# EAGLE design me433-hw4 (EAGLE 9.6.2)
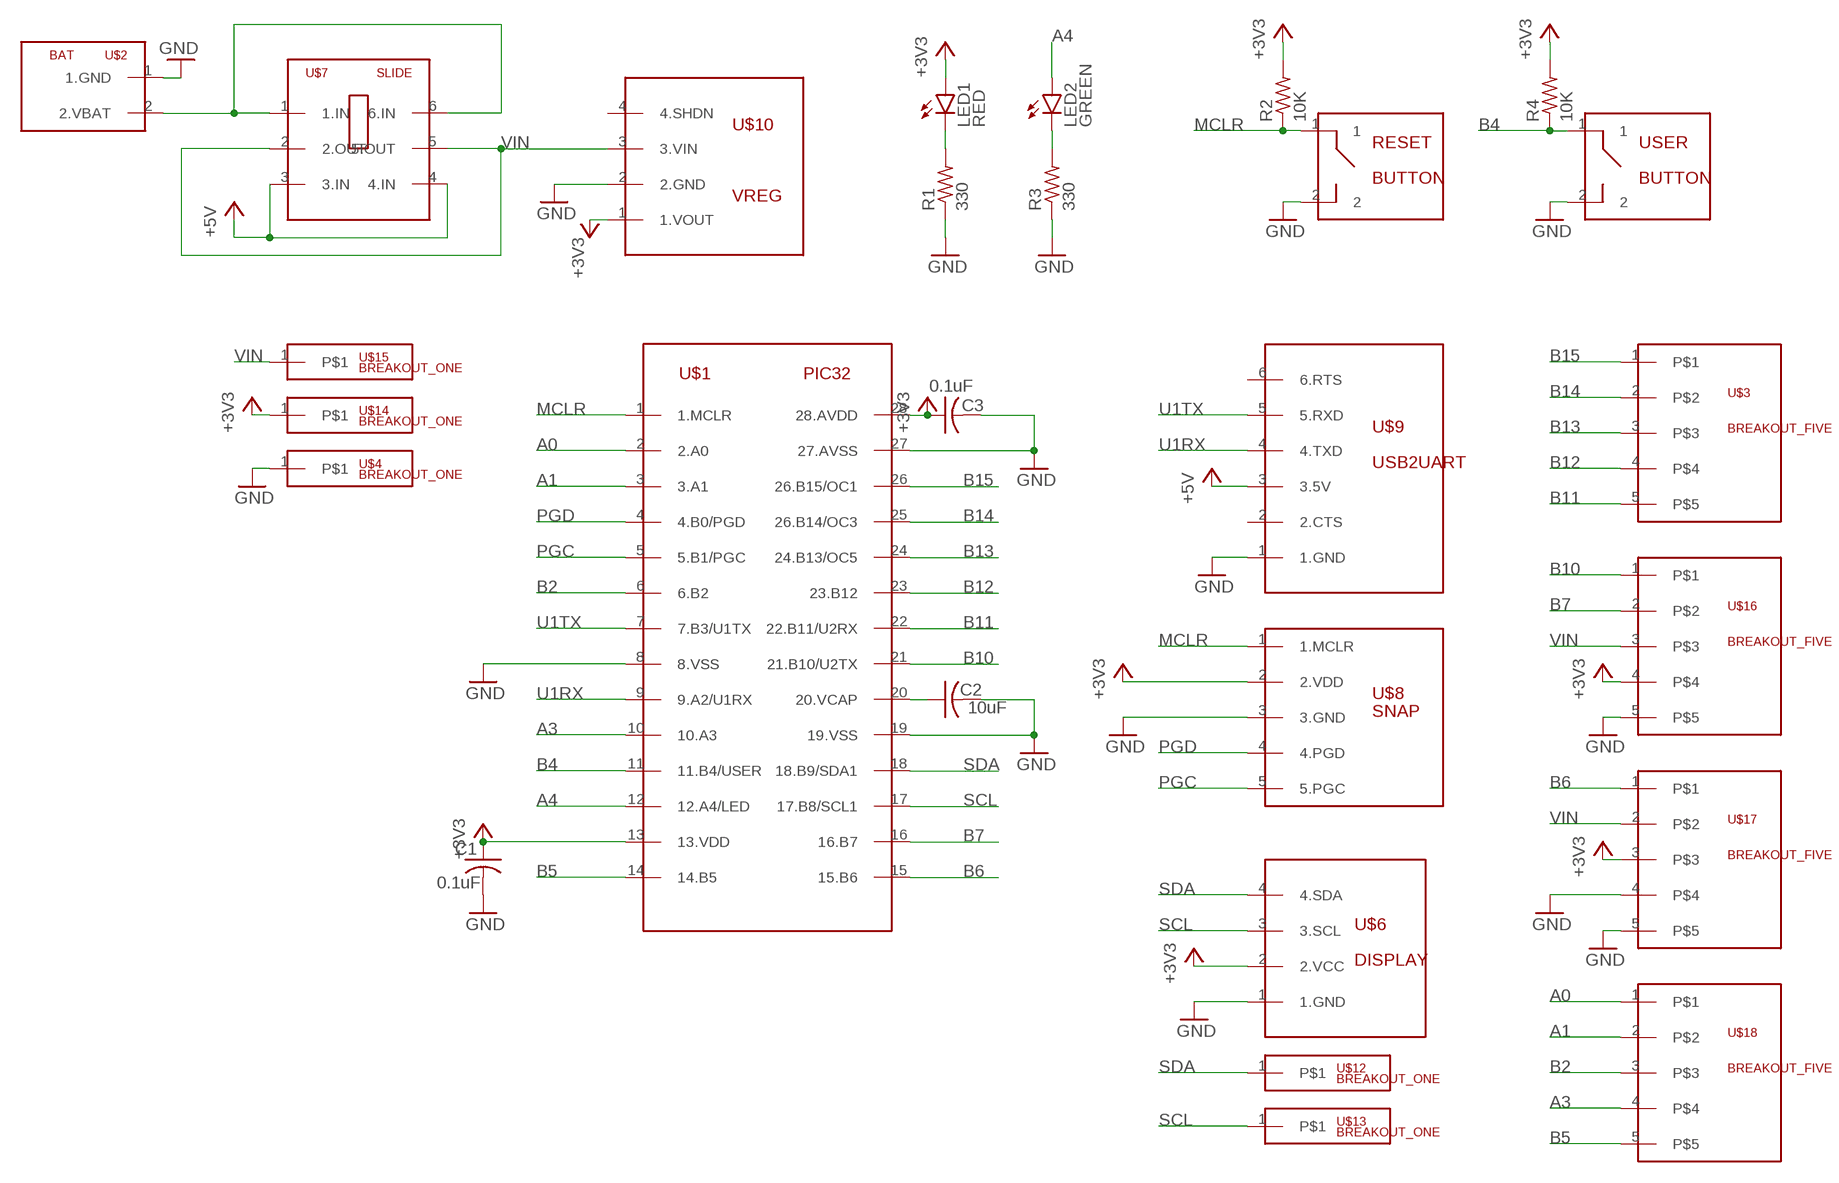
[diagram p0: schematic, sheet 1]

## Parts
C1  0.1uF  C-US025-024X044  [C025-024X044]
C2  10uF  C-US025-024X044  [C025-024X044]
C3  0.1uF  C-US025-024X044  [C025-024X044]
LED1  RED  LED3MM  [LED3MM]
LED2  GREEN  LED3MM  [LED3MM]
R1  330  R-US_0207/7  [0207/7]
R2  10K  R-US_0207/7  [0207/7]
R3  330  R-US_0207/7  [0207/7]
R4  10K  R-US_0207/7  [0207/7]
RESET  BUTTON  [BUTTON]
U$1  PIC32  [DIL28-3]
U$2  BAT  [BAT]
U$3  BREAKOUT_FIVE  [BREAKOUT_FIVE]
U$4  BREAKOUT_ONE  [BREAKOUT_ONE]
U$6  DISPLAY  [DISPLAY]
U$7  SLIDE  [SLIDE]
U$8  SNAP  [SNAP]
U$9  USB2UART  [USB2UART]
U$10  VREG  [VREG]
U$12  BREAKOUT_ONE  [BREAKOUT_ONE]
U$13  BREAKOUT_ONE  [BREAKOUT_ONE]
U$14  BREAKOUT_ONE  [BREAKOUT_ONE]
U$15  BREAKOUT_ONE  [BREAKOUT_ONE]
U$16  BREAKOUT_FIVE  [BREAKOUT_FIVE]
U$17  BREAKOUT_FIVE  [BREAKOUT_FIVE]
U$18  BREAKOUT_FIVE  [BREAKOUT_FIVE]
USER  BUTTON  [BUTTON]

## Nets
+3V3: C1.1 C3.1 LED1.A R2.2 R4.2 U$1.13(13.VDD) U$1.28(28.AVDD) U$6.2(2.VCC) U$8.2(2.VDD) U$10.1(1.VOUT) U$14.1 U$16.4 U$17.3
+5V: U$7.3(3.IN) U$7.4(4.IN) U$9.3(3.5V)
A0: U$1.2(2.A0) U$18.1
A1: U$1.3(3.A1) U$18.2
A3: U$1.10(10.A3) U$18.4
A4: LED2.A U$1.12(12.A4/LED)
B2: U$1.6(6.B2) U$18.3
B4: R4.1 U$1.11(11.B4/USER) USER.1
B5: U$1.14(14.B5) U$18.5
B6: U$1.15(15.B6) U$17.1
B7: U$1.16(16.B7) U$16.2
B10: U$1.21(21.B10/U2TX) U$16.1
B11: U$1.22(22.B11/U2RX) U$3.5
B12: U$1.23(23.B12) U$3.4
B13: U$1.24(24.B13/OC5) U$3.3
B14: U$1.25(26.B14/OC3) U$3.2
B15: U$1.26(26.B15/OC1) U$3.1
GND: C1.2 C2.2 C3.2 R1.1 R3.1 RESET.2 U$1.8(8.VSS) U$1.19(19.VSS) U$1.27(27.AVSS) U$2.1(1.GND) U$4.1 U$6.1(1.GND) U$8.3(3.GND) U$9.1(1.GND) U$10.2(2.GND) U$16.5 U$17.4 U$17.5 USER.2
MCLR: R2.1 RESET.1 U$1.1(1.MCLR) U$8.1(1.MCLR)
N$1: U$2.2(2.VBAT) U$7.1(1.IN) U$7.6(6.IN)
N$7: C2.1 U$1.20(20.VCAP)
N$9: LED2.K(C) R3.2
N$10: LED1.K(C) R1.2
PGC: U$1.5(5.B1/PGC) U$8.5(5.PGC)
PGD: U$1.4(4.B0/PGD) U$8.4(4.PGD)
SCL: U$1.17(17.B8/SCL1) U$6.3(3.SCL) U$13.1
SDA: U$1.18(18.B9/SDA1) U$6.4(4.SDA) U$12.1
U1RX: U$1.9(9.A2/U1RX) U$9.4(4.TXD)
U1TX: U$1.7(7.B3/U1TX) U$9.5(5.RXD)
VIN: U$7.2(2.OUT) U$7.5(5.OUT) U$10.3(3.VIN) U$15.1 U$16.3 U$17.2
Unconnected: U$9.2(2.CTS) U$9.6(6.RTS) U$10.4(4.SHDN)

## Library data of the parts
C1-C3 = me433_hw4:C-US: CAPACITOR, American symbol; SPICEPREFIX: C
LED1 LED2 = me433_hw4:LED: LED OSRAM: - CHIPLED LG R971, LG N971, LY N971, LG Q971, LY Q971, LO R971, LY R971 LH N974, LH R974 LS Q976, LO Q976, LY Q976 LO Q996 - Hyper CHIPLED LW Q18S LB Q993, LB Q99A, LB R99A - SideLED LS A670, LO A670, LY A670, LG A670, LP A670 LB A673, LV A673, LT A673, LW A673 LH A674 LY A675 LS A676, LA A676, LO A676, LY A676, LW A676 LS A679, LY A679, LG A679 - Hyper Micro SIDELED® LS Y876, LA Y876, LO Y876, LY Y876 LT Y87S - SmartLED LW L88C, LW L88S LB L89C, LB L89S, LG L890 LS L89K, LO L89K, LY L89K LS L896, LA L896, LO L896, LY L896 - TOPLED LS T670, LO T670, LY T670, LG T670, LP T670 LSG T670, LSP T670, LSY T670, LOP T670, LYG T670 LG T671, LOG T671, LSG T671 LB T673, LV T673, LT T673, LW T673 LH T674 LS T676, LA T676, LO T676, LY T676, LB T676, LH T676, LSB T676, LW T676 LB T67C, LV T67C, LT T67C, LS T67K, LO T67K, LY T67K, LW E67C LS E67B, LA E67B, LO E67B, LY E67B, LB E67C, LV E67C, LT E67C LW T67C LS T679, LY T679, LG T679 LS T770, LO T770, LY T770, LG T770, LP T770 LB T773, LV T773, LT T773, LW T773 LH T774 LS E675, LA E675, LY E675, LS T675 LS T776, LA T776, LO T776, LY T776, LB T776 LHGB T686 LT T68C, LB T68C - Hyper Mini TOPLED® LB M676 - Mini TOPLED Santana® LG M470 LS M47K, LO M47K, LY M47K Source: http://www.osram.convergy.de LUXEON: - LUMILED® LXK2-PW12-R00, LXK2-PW12-S00, LXK2-PW14-U00, LXK2-PW14-V00 LXK2-PM12-R00, LXK2-PM12-S00, LXK2-PM14-U00 LXK2-PE12-Q00, LXK2-PE12-R00, LXK2-PE12-S00, LXK2-PE14-T00, LXK2-PE14-U00 LXK2-PB12-K00, LXK2-PB12-L00, LXK2-PB12-M00, LXK2-PB14-N00, LXK2-PB14-P00, LXK2-PB14-Q00 LXK2-PR12-L00, LXK2-PR12-M00, LXK2-PR14-Q00, LXK2-PR14-R00 LXK2-PD12-Q00, LXK2-PD12-R00, LXK2-PD12-S00 LXK2-PH12-R00, LXK2-PH12-S00 LXK2-PL12-P00, LXK2-PL12-Q00, LXK2-PL12-R00 Source: www.luxeon.com KINGBRIGHT: KA-3528ASYC Source: www.kingbright.com
R1-R4 = me433_hw4:R-US_: RESISTOR, American symbol; SPICEPREFIX: R
RESET USER = me433_hw4:BUTTON
U$1 = me433_hw4:PIC32
U$2 = me433_hw4:BAT
U$3 U$16-U$18 = me433_hw4:BREAKOUT_FIVE
U$4 U$12-U$15 = me433_hw4:BREAKOUT_ONE
U$6 = me433_hw4:DISPLAY
U$7 = me433_hw4:SLIDE
U$8 = me433_hw4:SNAP
U$9 = me433_hw4:USB2UART
U$10 = me433_hw4:VREG

## Board
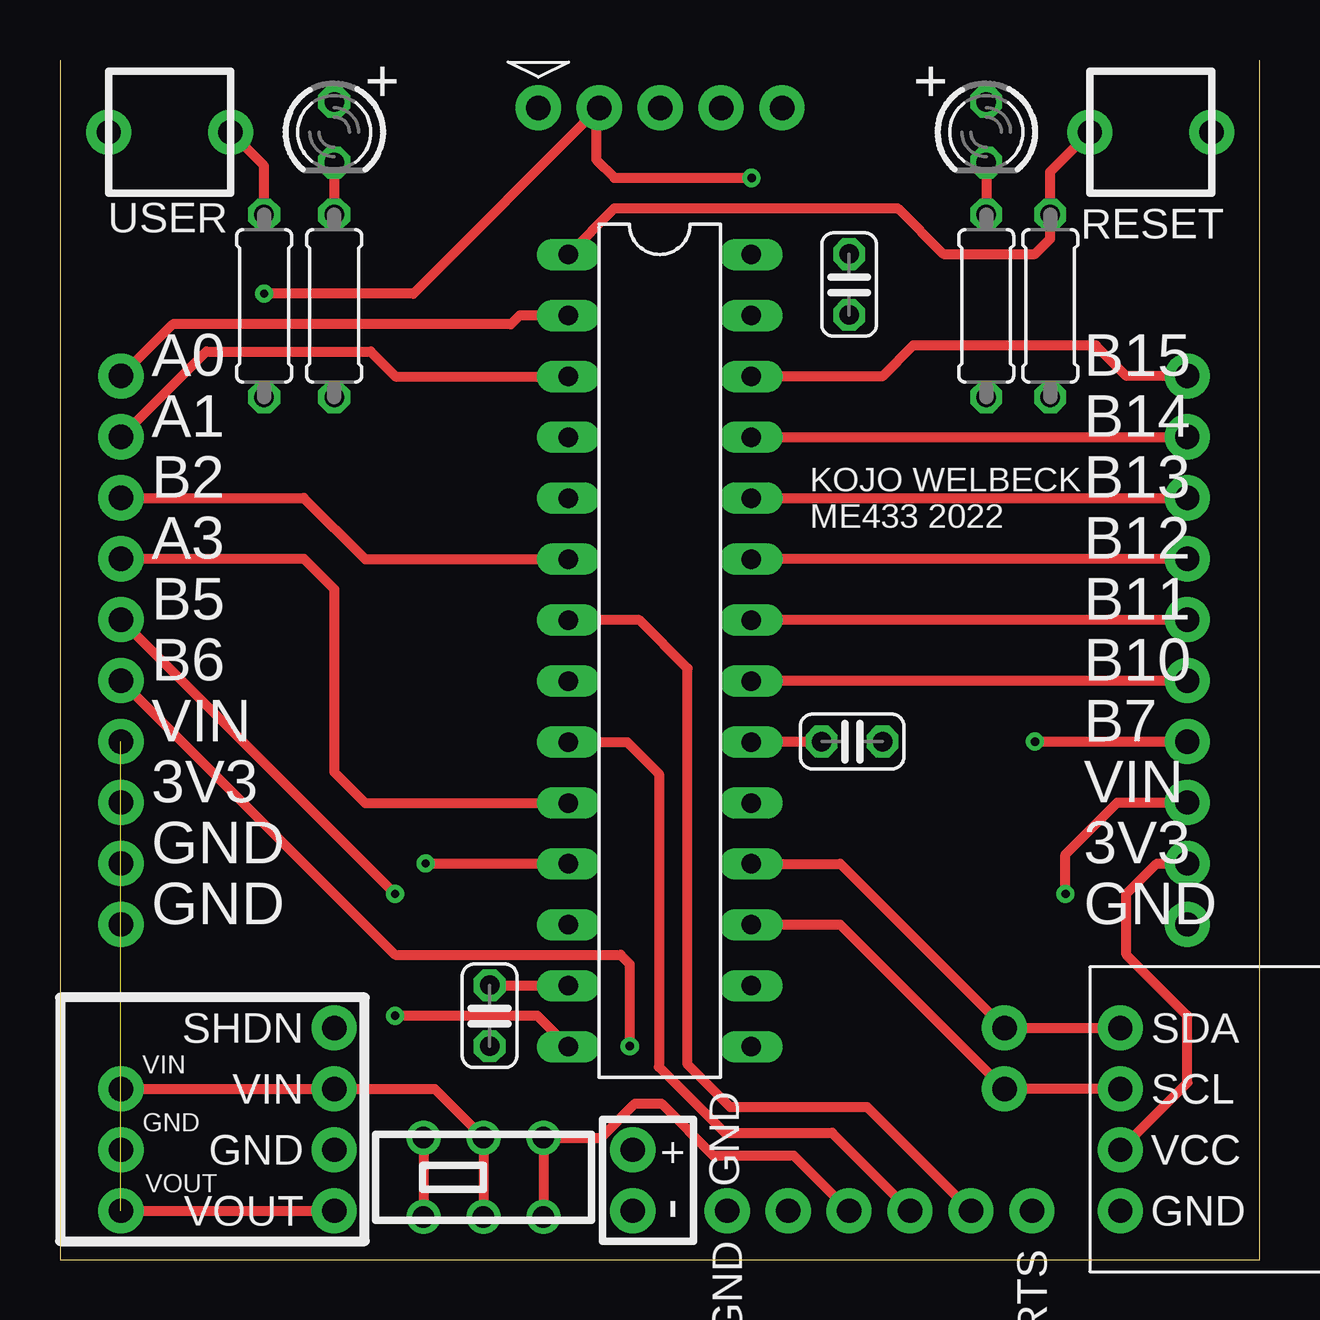
[diagram p1: board, top side]
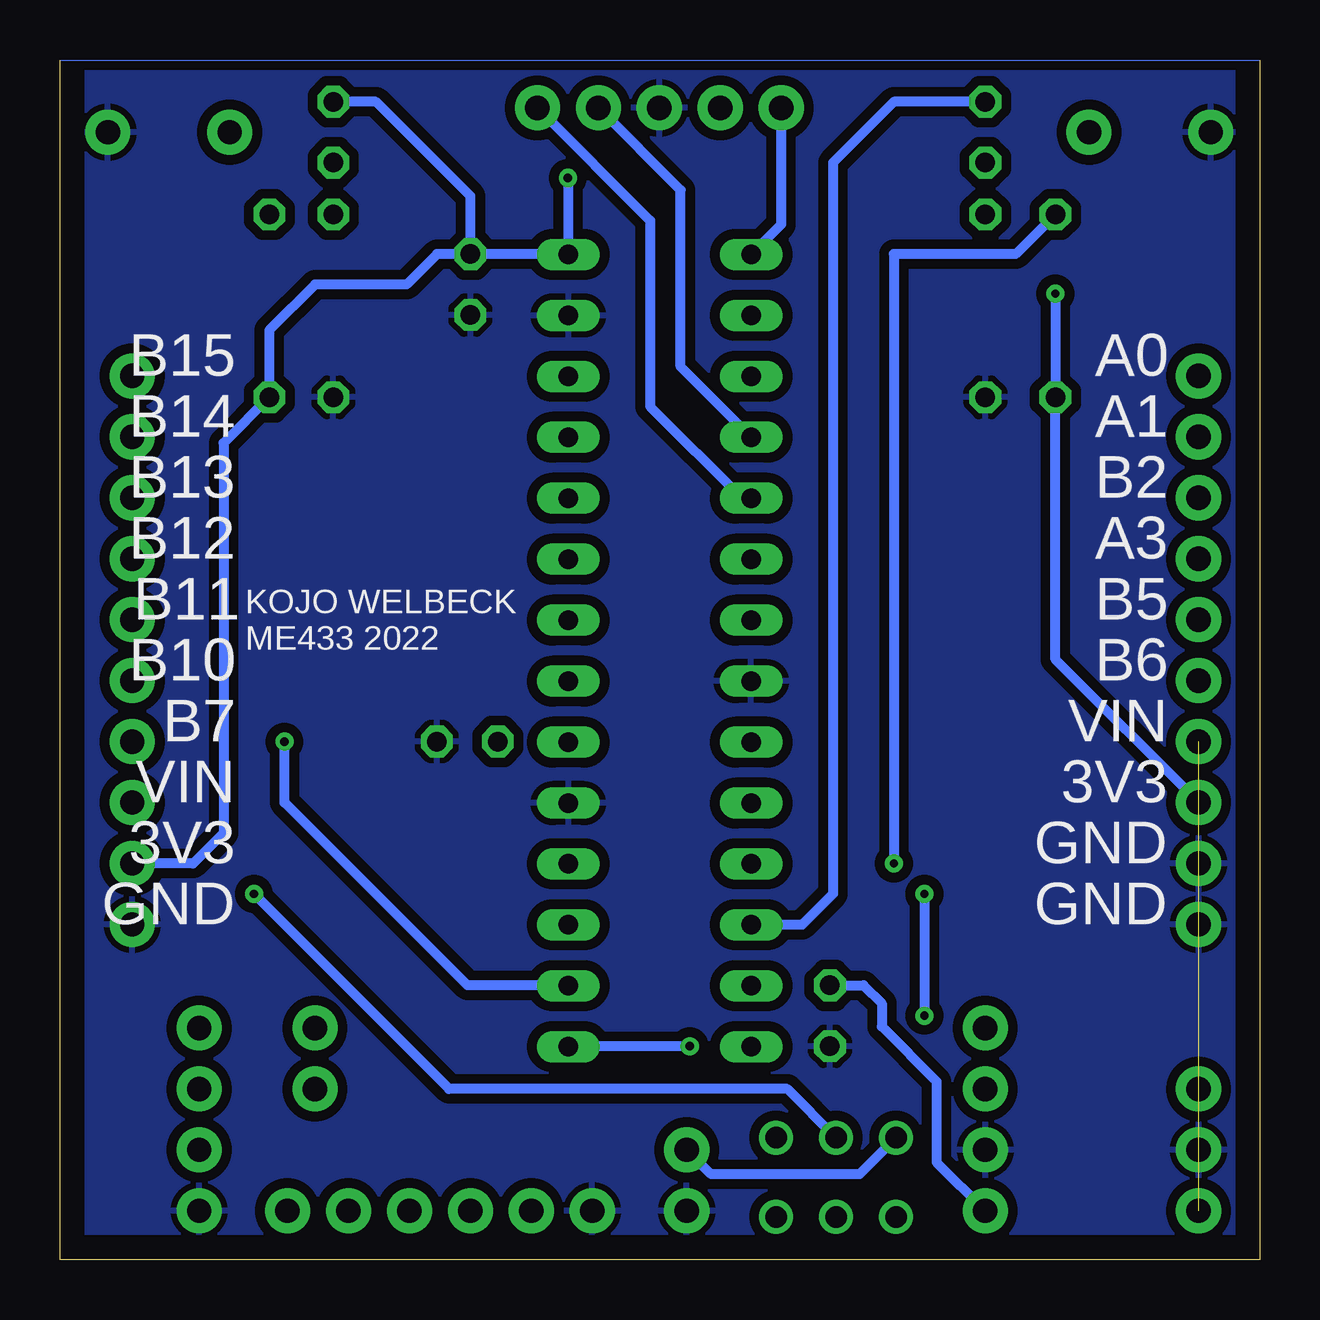
[diagram p2: board, bottom side, seen from below]

Size 50 x 50 mm. Coordinates in mm from the lower left corner, seen from the top.
Outline: 50,50 50,0 0,0 0,50
Copper layers (1*16): Top 0.035mm / dielectric 1.5mm / Bottom 0.035mm
Design rules "default": minimum track width 6mil, minimum drill 0.35mm, track to track 6mil, track to pad 6mil, pad to pad 6mil, via to via 6mil, smd to smd 6mil, copper to edge 40mil, drill to drill 6mil, minimum pad ring 10mil, minimum via ring 8mil, stop-mask expansion 4mil, vias tented up to drill 0mil, thermal gap 10mil

### Footprints (pad centres in the part's own frame; a part is rotated, then mirrored left to right if it is on the bottom)
C025-024X044 = drill 0.813 octagon: 1 -1.27,0; 2 1.27,0
LED3MM = drill 0.813 octagon: A -1.27,0; K 1.27,0
0207/7 = drill 0.813 octagon: 1 -3.81,0; 2 3.81,0
BUTTON = drill 1.016 pad 1.88: 1 -2.54,0; 2 2.54,0
DIL28-3 = drill 0.813 long: 1 -16.51,-3.81; 2 -13.97,-3.81; 3 -11.43,-3.81; 4 -8.89,-3.81; 5 -6.35,-3.81; 6 -3.81,-3.81; 7 -1.27,-3.81; 8 1.27,-3.81; 9 3.81,-3.81; 10 6.35,-3.81; 11 8.89,-3.81; 12 11.43,-3.81; 13 13.97,-3.81; 14 16.51,-3.81; 15 16.51,3.81; 16 13.97,3.81; 17 11.43,3.81; 18 8.89,3.81; 19 6.35,3.81; 20 3.81,3.81; 21 1.27,3.81; 22 -1.27,3.81; 23 -3.81,3.81; 24 -6.35,3.81; 25 -8.89,3.81; 26 -11.43,3.81; 27 -13.97,3.81; 28 -16.51,3.81
BAT = drill 1.016 pad 1.88: 1 -1.27,0; 2 1.27,0
BREAKOUT_FIVE = drill 1.016 pad 1.88: 1 -5.08,0; 2 -2.54,0; 3 0,0; 4 2.54,0; 5 5.08,0
BREAKOUT_ONE = drill 1.016 pad 1.88: 1 0,0
DISPLAY = drill 1.016 pad 1.88: 1 0,-3.81; 2 0,-1.27; 3 0,1.27; 4 0,3.81
SLIDE = drill 0.9: 1 -2.5,-1.65; 2 0,-1.65; 3 2.5,-1.65; 4 2.5,1.65; 5 0,1.65; 6 -2.5,1.65
SNAP = drill 1.016 pad 1.88: 1 -3.81,3.81; 2 -1.27,3.81; 3 1.27,3.81; 4 3.81,3.81; 5 6.35,3.81
USB2UART = drill 1.016 pad 1.88: 1 -6.35,0; 2 -3.81,0; 3 -1.27,0; 4 1.27,0; 5 3.81,0; 6 6.35,0
VREG = drill 1.016 pad 1.88: 1 -3.81,0; 2 -1.27,0; 3 1.27,0; 4 3.81,0

### Placement (x,y rotation side)
C1  17.91,10.16 270 top
C2  33.02,21.59 0 top
C3  32.89,40.64 270 top
LED1  38.61,46.99 270 top
LED2  11.43,46.99 270 top
R1  38.61,39.75 90 top
R2  41.27,39.75 270 top
R3  11.43,39.75 90 top
R4  8.51,39.75 270 top
RESET  45.47,46.99 0 top
U$1  25,25.38 270 top
U$2  23.88,3.3 90 top
U$3  46.99,31.75 270 top
U$4  2.54,4.57 0 top
U$6  44.2,5.84 0 top
U$7  17.65,3.43 0 top
U$8  23.75,44.2 0 top
U$9  34.16,2.03 0 top
U$10  11.43,5.84 90 top
U$12  39.37,9.65 0 top
U$13  39.37,7.11 0 top
U$14  2.54,2.03 0 top
U$15  2.54,7.11 0 top
U$16  46.99,19.05 270 top
U$17  2.54,19.05 270 top
U$18  2.54,31.75 270 top
USER  4.57,46.99 180 top

### Tracks (layer width: path | path; a pad name or v marks a point on that pad's centre or on a via)
+3V3  (via drill 0.35)  (1 unrouted)
  Top 0.406: U$14.1 U$10.1 | U$1.28 v28.83,41.91 | C1.1 21.17,11.43 U$1.13 | U$6.2 46.99,7.37 46.99,10.16 44.45,12.7 44.45,15.24 45.72,16.51 U$16.4 | v28.83,45.09 23.11,45.09 22.35,45.85 22.35,47.88 U$8.2 14.73,40.26 v8.51,40.26
  Bottom 0.406: C3.1 v28.83,41.91 v28.83,45.09 | C3.1 32.89,44.32 36.83,48.26 LED1.A | C3.1 34.29,41.91 35.56,40.64 39.37,40.64 41.27,38.73 R2.2 43.18,34.04 43.18,17.78 44.45,16.51 U$16.4 | v8.51,40.26 R4.2 8.51,25.02 U$17.3 | C1.1 16.51,11.43 15.75,10.67 15.75,9.71 13.46,7.42 13.46,4.06 U$10.1
+5V
  Top 0.406: U$7.3 U$7.4 22.55,5.08 23.97,6.5 25.06,6.5 27.22,4.34 30.58,4.34 U$9.3
A0
  Top 0.406: U$18.1 4.7,38.99 18.8,38.99 19.16,39.35 U$1.2
A1
  Top 0.406: U$18.2 6.1,37.85 12.95,37.85 13.99,36.81 U$1.3
A3
  Top 0.406: U$18.4 10.16,29.21 11.43,27.94 11.43,20.32 12.72,19.03 U$1.10
A4
  Bottom 0.406: LED2.A 15.24,48.26 17.78,45.72 17.78,15.24 19.07,13.95 U$1.12
B2
  Top 0.406: U$18.3 10.16,31.75 12.72,29.19 U$1.6
B4  (via drill 0.35)
  Top 0.406: R4.1 8.51,45.59 USER.1 | v15.24,16.51 21.17,16.51 U$1.11
  Bottom 0.406: R4.1 10.16,41.91 15.24,41.91 v15.24,16.51
B5  (via drill 0.35)
  Top 0.406: U$18.5 v13.97,15.24 | v13.97,10.16 19.9,10.16 U$1.14
  Bottom 0.406: v13.97,15.24 v13.97,10.16
B6  (via drill 0.35)
  Top 0.406: U$17.1 13.97,12.7 23.37,12.7 23.75,12.32 v23.75,8.89
  Bottom 0.406: v23.75,8.89 28.79,8.89 U$1.15
B7  (via drill 0.35)
  Top 0.406: v40.64,21.59 U$16.2
  Bottom 0.406: U$1.16 28.83,11.43 33.02,11.43 40.64,19.05 v40.64,21.59
B10
  Top 0.406: U$1.21 28.83,24.13 U$16.1
B11
  Top 0.406: U$1.22 28.83,26.67 U$3.5
B12
  Top 0.406: U$1.23 28.83,29.21 U$3.4
B13
  Top 0.406: U$1.24 28.83,31.75 U$3.3
B14
  Top 0.406: U$1.25 28.83,34.29 U$3.2
B15
  Top 0.406: U$3.1 44.45,36.83 43.18,38.1 35.56,38.1 34.27,36.81 U$1.26
GND
  pour Bottom (isolate 0.406): 0,0 53.34,0 53.34,52.07 0,52.07
MCLR
  Top 0.406: RESET.1 41.27,45.34 R2.1 41.27,42.55 40.64,41.91 36.83,41.91 34.92,43.81 23.11,43.81 U$1.1
  Bottom 0.406: U$8.1 19.94,43.14 U$1.1
N$1
  Top 0.406: U$7.6 U$7.1
  Bottom 0.406: U$7.6 16.68,3.56 22.86,3.56 U$2.2
N$2
  Bottom 0: 50,50 0,50
N$7
  Top 0.406: U$1.20 28.83,21.59 C2.1
N$9
  Top 0.406: LED2.K R3.2
N$10
  Top 0.406: LED1.K R1.2
PGC
  Bottom 0.406: U$8.5 25.4,43.31 25.4,35.56 21.57,31.73 U$1.5
PGD
  Bottom 0.406: U$1.4 24.13,37.21 24.13,44.58 U$8.4
SCL
  Top 0.406: U$6.3 U$13.1 32.53,13.95 U$1.17
SDA
  Top 0.406: U$6.4 U$12.1 32.53,16.49 U$1.18
U1RX
  Top 0.406: U$1.9 23.64,21.57 24.97,20.24 24.97,8.02 27.71,5.28 32.18,5.28 U$9.4
U1TX
  Top 0.406: U$9.5 33.66,6.35 27.94,6.35 26.16,8.13 26.16,24.64 24.15,26.65 U$1.7
VIN  (via drill 0.35)  (1 unrouted)
  Top 0.406: U$15.1 U$10.3 15.62,7.11 U$7.5 U$7.2 | v41.91,15.24 41.91,16.89 44.07,19.05 U$16.3
  Bottom 0.406: U$7.5 19.69,7.11 33.78,7.11 v41.91,15.24

### Text on the board
tPlace: + | + | A0 | B15 | A1 | B14 | B2 | B13 | KOJO WELBECK / ME433 2022 | A3 | B12 | B5 | B11 | B6 | B10 | VIN | B7 | 3V3 | VIN | GND | 3V3 | GND | GND | VIN | GND | VOUT
bPlace: A0 | B15 | A1 | B14 | B2 | B13 | A3 | B12 | B5 | B11 | KOJO WELBECK / ME433 2022 | B6 | B10 | VIN | B7 | 3V3 | VIN | GND | 3V3 | GND | GND
tNames: GND